# Altium schematic sheet REVERSE_PROTECTION.SchDoc
size A3; SheetNumber: 3; SheetTotal: 16
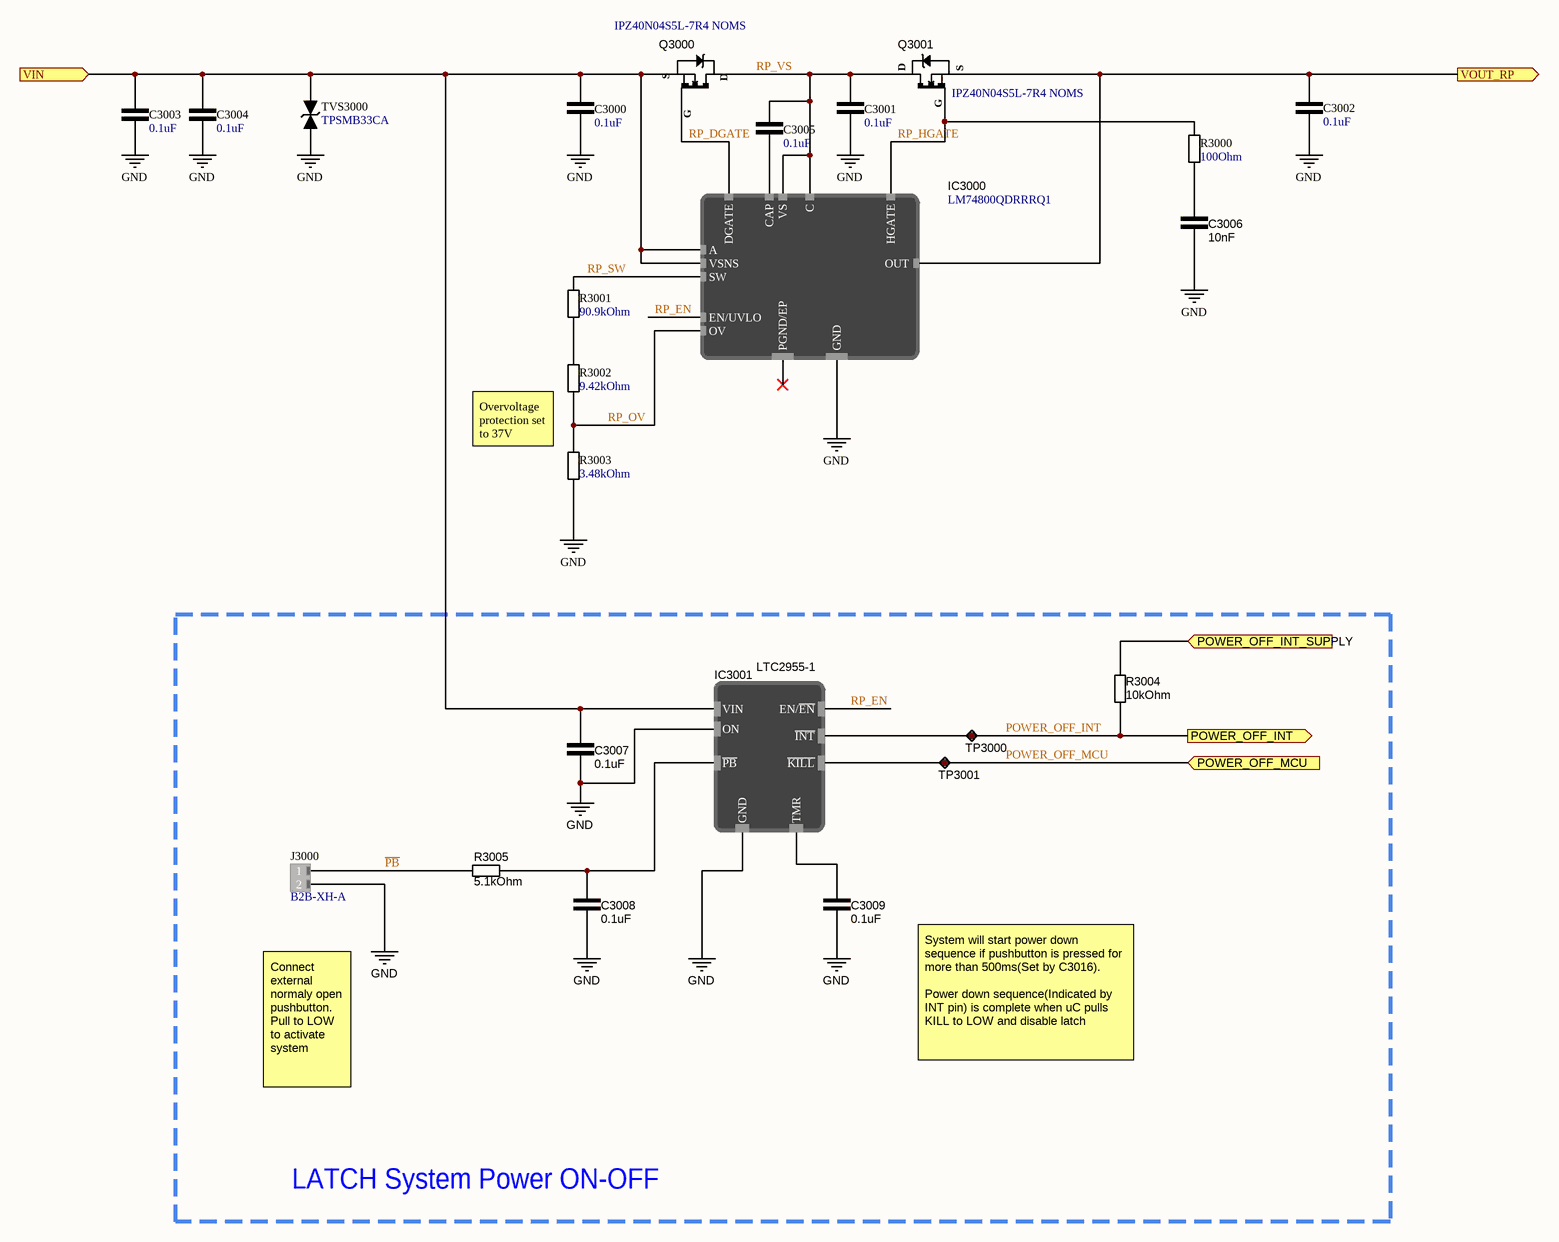
[diagram p0: REVERSE_PROTECTION.SchDoc]

## Parts
C3000  0.1uF  [CAP_0603]
C3001  0.1uF  [CAP_0603]
C3002  0.1uF  [CAP_0603]
C3003  0.1uF  [CAP_0603]
C3004  0.1uF  [CAP_0603]
C3005  0.1uF  [CAP_0603]
C3006  10nF  [CAP_0603]
C3007  0.1uF  [CAP_0603]
C3008  0.1uF  [CAP_0603]
C3009  0.1uF  [CAP_0603]
IC3000  LM74800QDRRRQ1  [SON50P300X80_HS-13N]
IC3001  LTC2955-1  [TSOP65P280X100-8N]
J3000  B2B-XH-A  [JST_XH_2POS]
Q3000  IPZ40N04S5L-7R4 NOMS  [PG-TSDSON-8-32]
Q3001  IPZ40N04S5L-7R4 NOMS  [PG-TSDSON-8-32]
R3000  100Ohm  [RES_0603]
R3001  90.9kOhm  [RES_0603]
R3002  9.42kOhm  [RES_0603]
R3003  3.48kOhm  [RES_0603]
R3004  10kOhm  [RES_0603]
R3005  5.1kOhm  [RES_0603]
TP3000  Test point  [TestPoint]  (value not drawn)
TP3001  Test point  [TestPoint]  (value not drawn)
TVS3000  TPSMB33CA  [DO-214AA]

## Ports
POWER_OFF_INT (out, see POWER_DELIVERY_AND_MONITORING[2A], POWER_DELIVERY_AND_MONITORING[1B]), POWER_OFF_INT_SUPPLY (in, see POWER_DELIVERY_AND_MONITORING[2A]), POWER_OFF_MCU (in, see POWER_DELIVERY_AND_MONITORING[2A], POWER_DELIVERY_AND_MONITORING[1B]), VIN (in, see POWER_DELIVERY_AND_MONITORING[1A]), VOUT_RP (out, see POWER_DELIVERY_AND_MONITORING[2A])

## Nets
GND: C3000.1 C3001.1 C3002.1 C3003.1 C3004.1 C3006.1 C3007.1 C3008.1 C3009.1 IC3000.7(GND) IC3001.1(ON) IC3001.4(GND) J3000.2 R3003.1 TVS3000.2(Anode)
~{PB}: J3000.1 R3005.1
POWER_OFF_INT: IC3001.8(~{INT}) R3004.1 TP3000.1 ; port POWER_OFF_INT
POWER_OFF_INT_SUPPLY: R3004.2 ; port POWER_OFF_INT_SUPPLY
POWER_OFF_MCU: IC3001.2(~{KILL}) TP3001.1 ; port POWER_OFF_MCU
RP_DGATE: IC3000.1(DGATE) Q3000.G(Gate)
RP_EN: IC3000.6(EN/UVLO) IC3001.7(EN/~{EN})
RP_HGATE: IC3000.8(HGATE) Q3001.G(Gate) R3000.2
RP_OV: IC3000.5(OV) R3002.1 R3003.2
RP_SW: IC3000.4(SW) R3001.2
RP_VS: C3001.2 C3005.2 IC3000.10(VS) IC3000.12(C) Q3000.D(Drain) Q3001.D(Drain)
VIN: C3000.2 C3003.2 C3004.2 C3007.2 IC3000.2(A) IC3000.3(VSNS) IC3001.6(VIN) Q3000.S(Source) TVS3000.1(Cathode) ; port VIN
VOUT_RP: C3002.2 IC3000.9(OUT) Q3001.S(Source) ; port VOUT_RP
NetC3005_1: C3005.1 IC3000.11(CAP)
NetC3006_2: C3006.2 R3000.1
NetC3008_2: C3008.2 IC3001.5(~{PB}) R3005.2
NetC3009_2: C3009.2 IC3001.3(TMR)
NetR3001_1: R3001.1 R3002.2

Not connected (* = marked no-connect by the designer): IC3000 13(PGND/EP)*

## Notes on the sheet
- Overvoltage protection set to 37V
- Connect external normaly open pushbutton.
  Pull to LOW to activate system
- System will start power down sequence if pushbutton is pressed for more than 500ms(Set by C3016).
  Power down sequence(Indicated by INT pin) is complete when uC pulls KILL to LOW and disable latch
- LATCH System Power ON-OFF

## Library data of the parts
C3000 C3001 C3005 C3007-C3009 = C000018: 0.1 µF ±10% 50V Ceramic Capacitor X7R 0603 (1608 Metric); ComponentLink1Description: DigiKey; ComponentLink1URL: https://www.digikey.com/en/products/detail/samsung-electro-mechanics/CL10B104KB8NNNC/3886658; DigiKey Part Number: 1276-1000-1-ND; capacitance: 0.1uF
C3002-C3004 = C000018: 0.1 µF ±10% 50V Ceramic Capacitor X7R 0603 (1608 Metric); Manufacturer Product Number: CL10B104KB8NNNC; capacitance: 0.1uF; ComponentLink1Description: DigiKey; ComponentLink1URL: https://www.digikey.com/en/products/detail/samsung-electro-mechanics/CL10B104KB8NNNC/3886658; DigiKey Part Number: 1276-1000-1-ND
C3006 = C000034: 10000 pF ±10% 50V Ceramic Capacitor X7R 0603 (1608 Metric); ComponentLink1Description: DigiKey; ComponentLink1URL: https://www.digikey.com/en/products/detail/kemet/C0603C103K5RACTU/411090; DigiKey Part Number: 399-C0603C103K5RACTUCT-ND; capacitance: 10nF
IC3000 = LM74800QDRRRQ1: OR Controller N+1 ORing Controller N-Channel 1:1 12-WSON (3x3); DigiKey Part Number: 296-LM74800QDRRRQ1CT-ND; ComponentLink1Description: DigiKey; ComponentLink1URL: https://www.digikey.com/en/products/detail/texas-instruments/LM74800QDRRRQ1/13627158; Mouser Part Number: 595-LM74800QDRRRQ1; ComponentLink2Description: Mouser; ComponentLink2URL: https://eu.mouser.com/ProductDetail/Texas-Instruments/LM74800QDRRRQ1?qs=KUoIvG%2F9IlYNgS7D9vQjYA%3D%3D
IC3001 = LTC2955-1: Power Supply Controller Push Button, On/Off Controller TSOT-23-8; DigiKey Part Number: 505-LTC2955CTS8-1#TRMPBFCT-ND; ComponentLink1Description: DigiKey; ComponentLink1URL: https://www.digikey.com/en/products/detail/analog-devices-inc/LTC2955CTS8-1-TRMPBF/3065178; Mouser Part Number: 584-C2955CTS8-1TMPF; ComponentLink2Description: Mouser; ComponentLink2URL: https://eu.mouser.com/ProductDetail/Analog-Devices/LTC2955CTS8-1TRMPBF?qs=hVkxg5c3xu%252B6Fq1Ir3bkGg%3D%3D
J3000 = 00000013: Connector Header Through Hole 2 position 0.098" (2.50mm); DigiKey Part Number: 455-B2B-XH-A-ND; ComponentLink1Description: DigiKey; ComponentLink1URL: https://www.digikey.com/en/products/detail/jst-sales-america-inc/B2B-XH-A/1651045; Manufacturer Product Number: B2B-XH-A
Q3000 Q3001 = 00000007: N-Channel 40 V 40A (Tc) 34W (Tc) Surface Mount PG-TSDSON-8; DigiKey Part Number: IPZ40N04S5L7R4ATMA1CT-ND; Mouser Part Number: 726-IPZ40N04S5L7R4AT; ComponentLink1Description: DigiKey; ComponentLink1URL: https://www.digikey.com/en/products/detail/infineon-technologies/IPZ40N04S5L7R4ATMA1/5960382; ComponentLink2Description: Mouser; ComponentLink2URL: https://eu.mouser.com/ProductDetail/Infineon-Technologies/IPZ40N04S5L7R4ATMA1?qs=RJIhqtkBntMJfptUOROQRQ%3D%3D; ComponentLink3Description: Footprint Drawing; ComponentLink3URL: https://www.infineon.com/cms/en/product/packages/PG-TSDSON/PG-TSDSON-8-32/#!downloads
R3000 = R000030: 100 Ohms ±1% 0.1W, 1/10W Chip Resistor 0603 (1608 Metric) Moisture Resistant Thick Film; ComponentLink1Description: DigiKey; ComponentLink1URL: https://www.digikey.com/en/products/detail/yageo/RC0603FR-07100RL/726888; resistance: 100Ohm; DigiKey Part Number: 311-100HRCT-ND
R3001 = R000027: 90.9 kOhms ±1% 0.1W, 1/10W Chip Resistor 0603 (1608 Metric) Automotive AEC-Q200 Thick Film; ComponentLink1Description: DigiKey; ComponentLink1URL: https://www.digikey.com/en/products/detail/panasonic-electronic-components/ERJ-3EKF9092V/196512; resistance: 90.9kOhm; DigiKey Part Number: P90.9KHCT-ND
R3002 = R000028: 9.42 kOhms ±1% 0.1W, 1/10W Chip Resistor 0603 (1608 Metric) Automotive AEC-Q200, Moisture Resistant Metal Film; ComponentLink1Description: DigiKey; ComponentLink1URL: https://www.digikey.com/en/products/detail/koa-speer-electronics-inc/RN73H1JTTD9421F25/10688584?s=N4IgjCBcoMxaBjKAzAhgGwM4FMA0IB7KAbXDBggF18AHAFyhAGU6AnASwDsBzEAX3xgAbPBBJIaLHkIkQMAJwAmACwjqIeoxYce-fIoAMADgCso8ZJz4ikUvIB0yxQAIA1gHkAFgFtMIdZqQIACqnOx07sgAstiomACurNh6IAC0iuZQbPHSNqRmlHwCIBm2IEmY7Jh0BKz%2BfEA; resistance: 9.42kOhm; DigiKey Part Number: 2019-RN73H1JTTD9421F25CT-ND
R3003 = R000029: 3.48 kOhms ±1% 0.1W, 1/10W Chip Resistor 0603 (1608 Metric) Automotive AEC-Q200 Thick Film; ComponentLink1Description: DigiKey; ComponentLink1URL: https://www.digikey.com/en/products/detail/stackpole-electronics-inc/RMCF0603FT3K48/1761028; resistance: 3.48kOhm; DigiKey Part Number: RMCF0603FT3K48CT-ND
R3004 = R000001: 10 kOhms ±1% 0.125W, 1/8W Chip Resistor 0603 (1608 Metric) Anti-Sulfur Thin Film; resistance: 10kOhm; ComponentLink1Description: DigiKey; ComponentLink1URL: https://www.digikey.com/en/products/detail/vishay-beyschlag-draloric-bc-components/MCT06030C1002FP500/1850440; DigiKey Part Number: MCT0603-10.0K-CFCT-ND
R3005 = R000013: 5.1 kOhms ±1% 0.1W, 1/10W Chip Resistor 0603 (1608 Metric) Moisture Resistant Thick Film; ComponentLink1Description: DigiKey; ComponentLink1URL: https://www.digikey.com/en/products/detail/yageo/RC0603FR-075K1L/727268; resistance: 5.1kOhm; DigiKey Part Number: 311-5.10KHRCT-ND
TP3000 TP3001 = TP002: Test point 1mm
TVS3000 = 00000015: 45.7V Clamp 13.3A Ipp Tvs Diode Surface Mount DO-214AA (SMBJ); DigiKey Part Number: F6323CT-ND; ComponentLink1Description: DigiKey; ComponentLink1URL: https://www.digikey.com/en/products/detail/littelfuse-inc/TPSMB33CA/4835275; Manufacturer Product Number: TPSMB33CA; JLCPCB Part Number: C224085